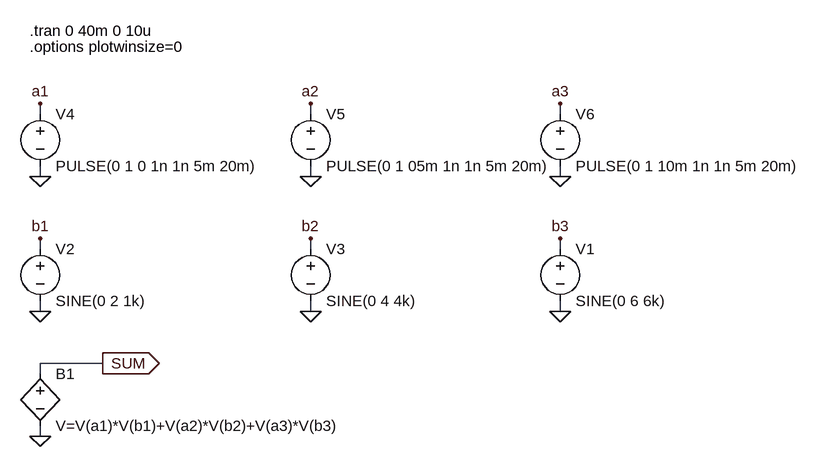
[diagram p0: schematic multi_freq_amp_source.asc]
multi_freq_amp_source.asc, the LTspice schematic file:
Version 4
SHEET 1 996 788
WIRE -224 32 -224 16
WIRE 192 32 192 16
WIRE 576 32 576 16
WIRE -224 128 -224 112
WIRE 192 128 192 112
WIRE 576 128 576 112
WIRE -224 240 -224 224
WIRE 192 240 192 224
WIRE 576 240 576 224
WIRE -224 336 -224 320
WIRE 192 336 192 320
WIRE 576 336 576 320
WIRE -128 416 -224 416
WIRE -224 432 -224 416
WIRE -224 528 -224 512
FLAG -224 128 0
FLAG -224 16 a1
FLAG 192 128 0
FLAG 192 16 a2
FLAG 576 128 0
FLAG 576 16 a3
FLAG -224 336 0
FLAG 192 336 0
FLAG 576 336 0
FLAG -224 224 b1
FLAG 192 224 b2
FLAG 576 224 b3
FLAG -224 528 0
FLAG -128 416 SUM
IOPIN -128 416 Out
SYMBOL voltage -224 224 R0
WINDOW 123 0 0 Left 2
WINDOW 39 0 0 Left 2
SYMATTR InstName V2
SYMATTR Value SINE(0 2 1k)
SYMBOL voltage 192 224 R0
SYMATTR InstName V3
SYMATTR Value SINE(0 4 4k)
SYMBOL voltage -224 16 R0
WINDOW 123 0 0 Left 2
WINDOW 39 0 0 Left 2
SYMATTR InstName V4
SYMATTR Value PULSE(0 1 0 1n 1n 5m 20m)
SYMBOL voltage 192 16 R0
WINDOW 123 0 0 Left 2
WINDOW 39 0 0 Left 2
SYMATTR InstName V5
SYMATTR Value PULSE(0 1 05m 1n 1n 5m 20m)
SYMBOL voltage 576 16 R0
WINDOW 123 0 0 Left 2
WINDOW 39 0 0 Left 2
SYMATTR InstName V6
SYMATTR Value PULSE(0 1 10m 1n 1n 5m 20m)
SYMBOL voltage 576 224 R0
SYMATTR InstName V1
SYMATTR Value SINE(0 6 6k)
SYMBOL bv -224 416 R0
SYMATTR InstName B1
SYMATTR Value V=V(a1)*V(b1)+V(a2)*V(b2)+V(a3)*V(b3)
TEXT -240 -96 Left 2 !.tran 0 40m 0 10u
TEXT -240 -72 Left 2 !.options plotwinsize=0

The netlist it stands for:
* multi_freq_amp_source.asc
V2 b1 0 SINE(0 2 1k)
V3 b2 0 SINE(0 4 4k)
V4 a1 0 PULSE(0 1 0 1n 1n 5m 20m)
V5 a2 0 PULSE(0 1 05m 1n 1n 5m 20m)
V6 a3 0 PULSE(0 1 10m 1n 1n 5m 20m)
V1 b3 0 SINE(0 6 6k)
B1 SUM 0 V=V(a1)*V(b1)+V(a2)*V(b2)+V(a3)*V(b3)
.tran 0 40m 0 10u
.options plotwinsize=0
.backanno
.end